# EAGLE design LabPower (EAGLE 7.7.0)
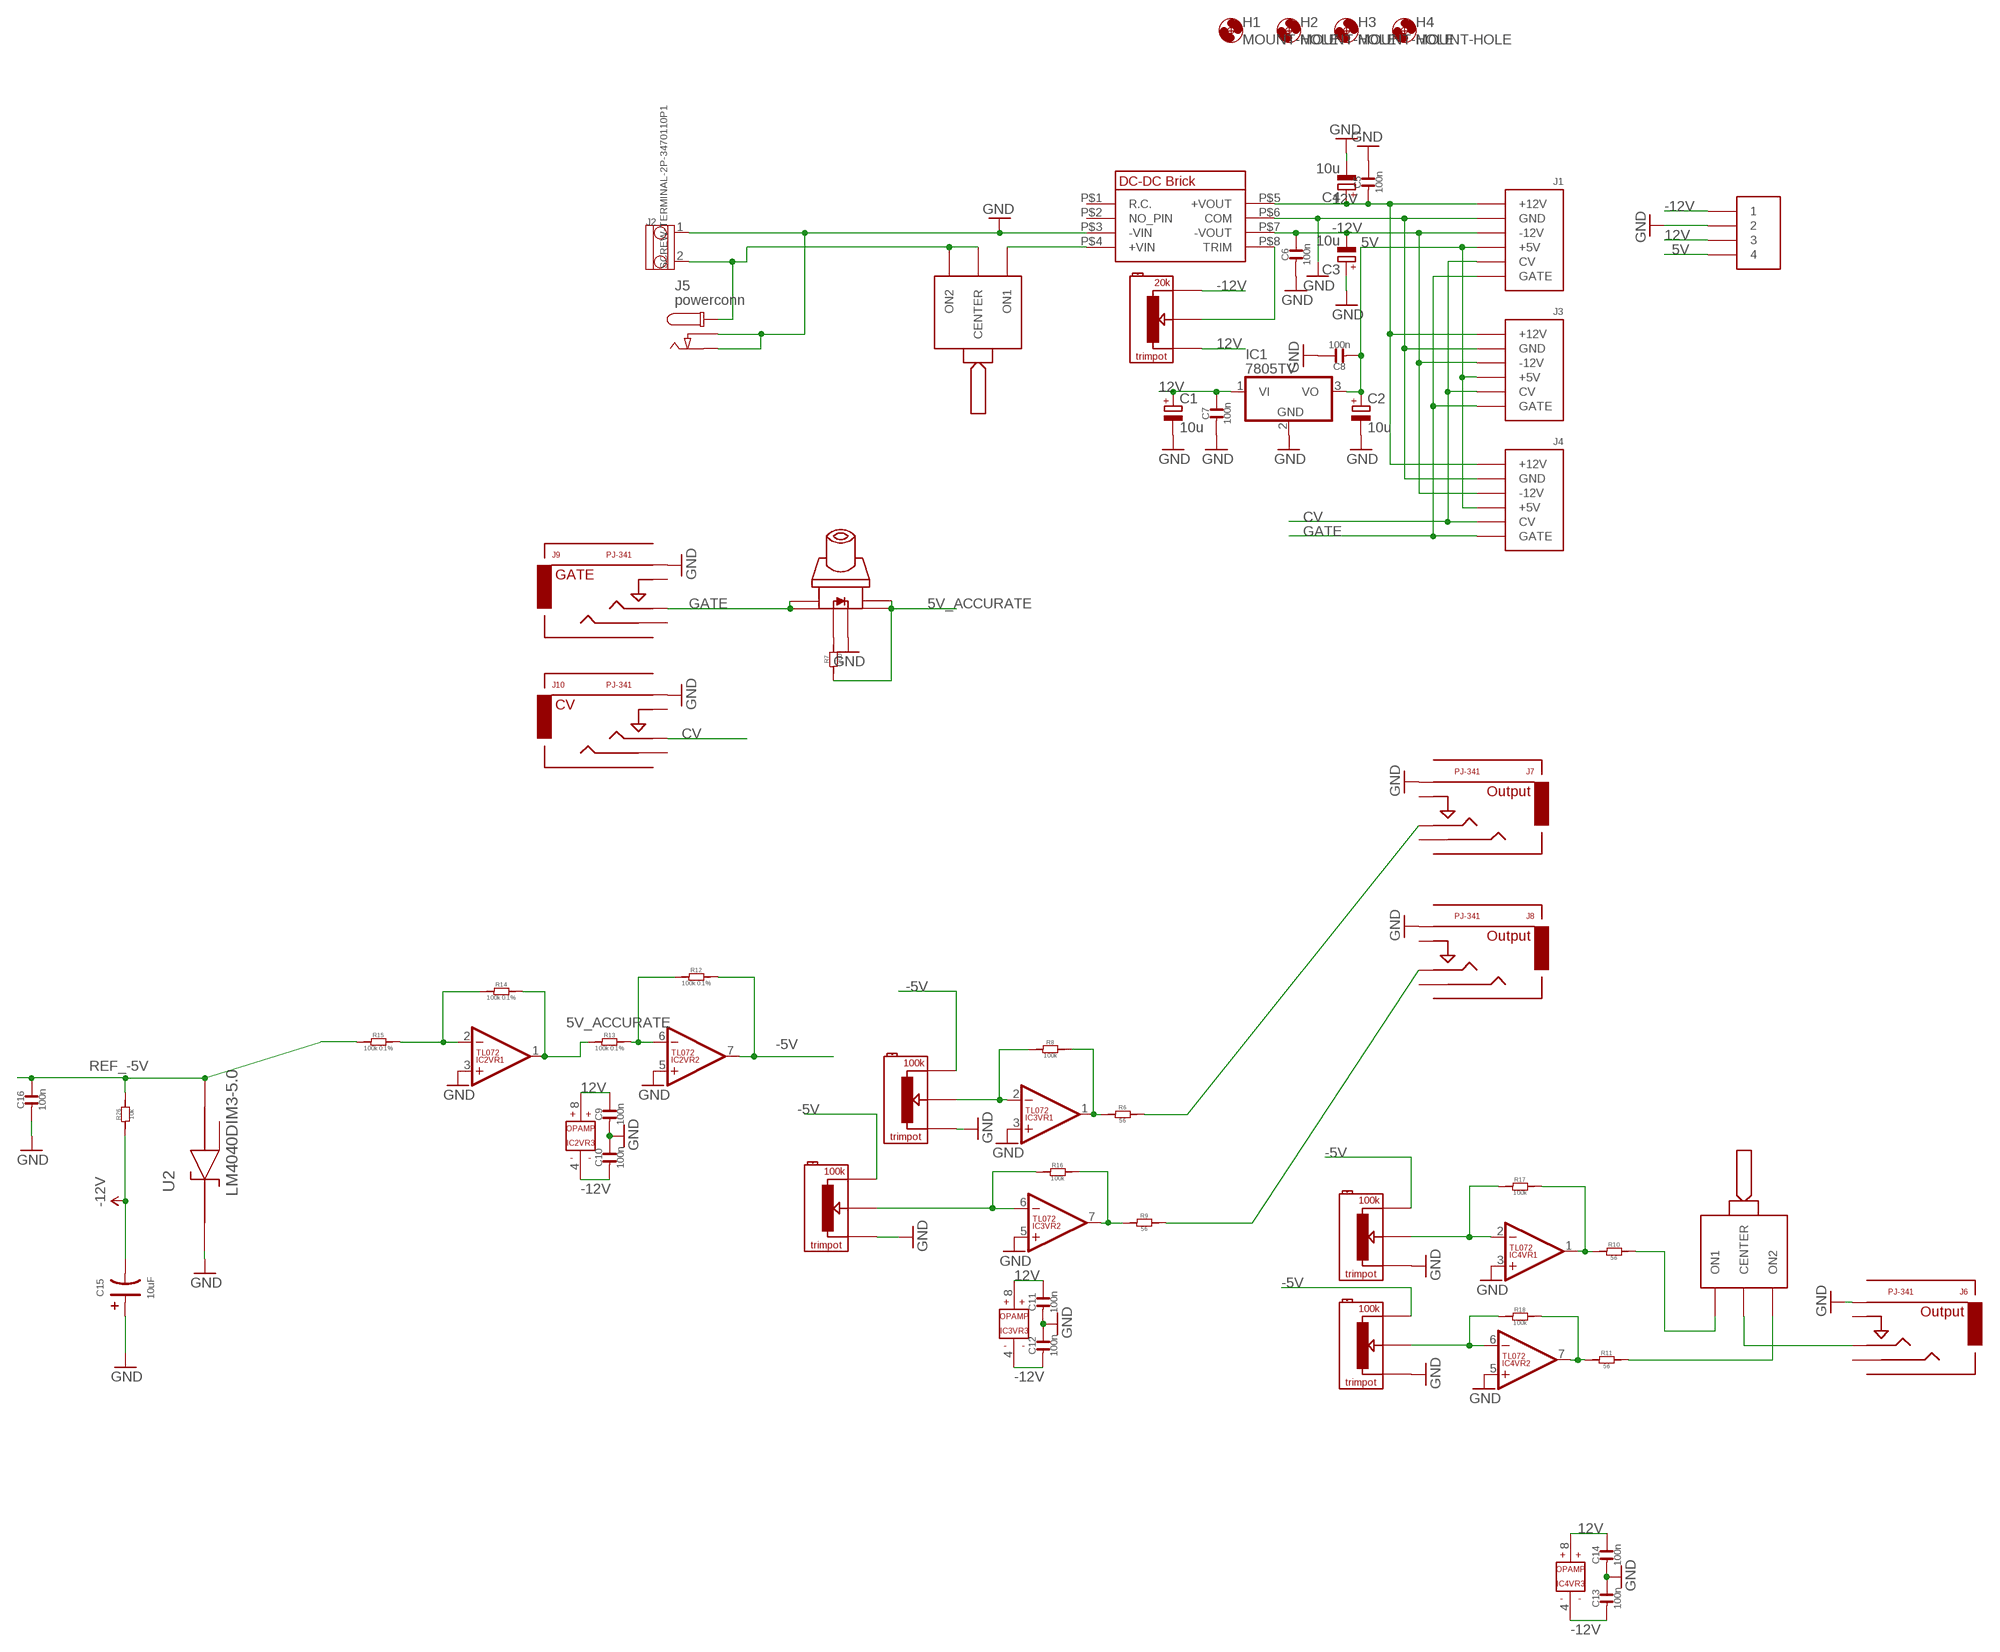
[diagram p0: schematic, sheet 1]

## Parts
C1  10u  CAPACITOR_POL-CASE_B  [CASE_B]
C2  10u  CAPACITOR_POL-CASE_B  [CASE_B]
C3  10u  CAPACITOR_POL-CASE_B  [CASE_B]
C4  10u  CAPACITOR_POL-CASE_B  [CASE_B]
C5  100n  C-0603  [C0603]
C6  100n  C-0603  [C0603]
C7  100n  C-0603  [C0603]
C8  100n  C-0603  [C0603]
C9  100n  C-0603  [C0603]
C10  100n  C-0603  [C0603]
C11  100n  C-0603  [C0603]
C12  100n  C-0603  [C0603]
C13  100n  C-0603  [C0603]
C14  100n  C-0603  [C0603]
C15  10uF  C-POLAR-A  [CASE-A_3216]
C16  100n  C-0603  [C0603]
H1  MOUNT-HOLE  [3.2-NOMARKINGS-SMALLSAFEZONE]
H2  MOUNT-HOLE  [3.2-NOMARKINGS-SMALLSAFEZONE]
H3  MOUNT-HOLE  [3.2-NOMARKINGS-SMALLSAFEZONE]
H4  MOUNT-HOLE  [3.2-NOMARKINGS-SMALLSAFEZONE]
IC1  7805TV  [TO220V]
IC2  TL072  [SO08]
IC3  TL072  [SO08]
IC4  TL072  [SO08]
J1  POWERSHROUDED  [POWER_16_SHROUDED]
J2  SCREW-TERMINAL-2P-3470110P1  [2P-5.0]
J3  POWER_SHROUDED_NOTEXT  [POWER_16_SHROUDED_NOTEXT]
J4  POWER_SHROUDED_NOTEXT  [POWER_16_SHROUDED_NOTEXT]
J5  powerconn  CON_DC_M-DC_PTH2  [DC_BARREL_JACK_PTH_2MM_2]
J6  PJ-341  AUDIO-JACKOUTPUT  [3.5MM-JACK-SWITCH-13MM-OUTPUT]
J7  PJ-341  AUDIO-JACKOUTPUT  [3.5MM-JACK-SWITCH-13MM-OUTPUT]
J8  PJ-341  AUDIO-JACKOUTPUT  [3.5MM-JACK-SWITCH-13MM-OUTPUT]
J9  PJ-341  AUDIO-JACKINPUT  [3.5MM-JACK-SWITCH-13MM-INPUT]
J10  PJ-341  AUDIO-JACKINPUT  [3.5MM-JACK-SWITCH-13MM-INPUT]
R1  20k  TRIMPOT  [TRIMPOT]
R2  100k  TRIMPOT  [TRIMPOT]
R3  100k  TRIMPOT  [TRIMPOT]
R4  100k  TRIMPOT  [TRIMPOT]
R5  100k  TRIMPOT  [TRIMPOT]
R6  56  R-0603  [R0603]
R7  200  R-0603  [R0603]
R8  100k  R-0603  [R0603]
R9  56  R-0603  [R0603]
R10  56  R-0603  [R0603]
R11  56  R-0603  [R0603]
R12  100k 0.1%  R-0603  [R0603]
R13  100k 0.1%  R-0603  [R0603]
R14  100k 0.1%  R-0603  [R0603]
R15  100k 0.1%  R-0603  [R0603]
R16  100k  R-0603  [R0603]
R17  100k  R-0603  [R0603]
R18  100k  R-0603  [R0603]
R26  10k  R-0603  [R0603]
S1  ONOFFON  [MULTICOMP1MS-ONOFFON]
S2  ONOFFON  [MULTICOMP1MS-ONOFFON]
S3  SWITCH_W_LED_PB6149L-X-102YELLOW  [PB6149L]
U2  LM4040DIM3-5.0  [SOT95P237X112-3N]
U$1  DKA30  [MEANWELL_DKA30]
U$2  4PIN5MM  [4PIN5MM]

## Nets
5V: C2.+ C8.1 IC1.3(VO) J1.11(+5V) J1.12(+5V) J3.11(+5V) J3.12(+5V) J4.11(+5V) J4.12(+5V) U$2.4
5V_ACCURATE: IC2.1(VR1:OUT) R7.1 R13.1 R14.2 S3.3 S3.4
12V: C1.+ C4.+ C5.1 C7.2 C9.2 C11.2 C14.2 IC1.1(VI) IC2.8(VR3:V+) IC3.8(VR3:V+) IC4.8(VR3:V+) J1.9(+12V) J1.10(+12V) J3.9(+12V) J3.10(+12V) J4.9(+12V) J4.10(+12V) R1.P$1 U$1.P$5(+VOUT) U$2.3
-5V: IC2.7(VR2:OUT) R2.P$3 R3.P$3 R4.P$3 R5.P$3 R12.2
-12V: C3.- C6.2 C10.1 C12.1 C13.1 C15.- IC2.4(VR3:V-) IC3.4(VR3:V-) IC4.4(VR3:V-) J1.1(-12V) J1.2(-12V) J3.1(-12V) J3.2(-12V) J4.1(-12V) J4.2(-12V) R1.P$3 R26.1 U$1.P$7(-VOUT) U$2.1
CV: J1.13(CV) J1.14(CV) J3.13(CV) J3.14(CV) J4.13(CV) J4.14(CV) J10.TIP@3(TIP)
GATE: J1.15(GATE) J1.16(GATE) J3.15(GATE) J3.16(GATE) J4.15(GATE) J4.16(GATE) J9.TIP@3(TIP) S3.1 S3.2
GND: C1.- C2.- C3.+ C4.- C5.2 C6.1 C7.1 C8.2 C9.1 C10.2 C11.1 C12.2 C13.2 C14.1 C15.+ C16.1 IC1.2(GND) IC2.3(VR1:+IN) IC2.5(VR2:+IN) IC3.3(VR1:+IN) IC3.5(VR2:+IN) IC4.3(VR1:+IN) IC4.5(VR2:+IN) J1.3(GND) J1.4(GND) J1.5(GND) J1.6(GND) J1.7(GND) J1.8(GND) J2.1 J3.3(GND) J3.4(GND) J3.5(GND) J3.6(GND) J3.7(GND) J3.8(GND) J4.3(GND) J4.4(GND) J4.5(GND) J4.6(GND) J4.7(GND) J4.8(GND) J5.P2(P3) J5.P3(P2) J6.RING@3(RING) J7.RING@3(RING) J8.RING@3(RING) J9.RING@3(RING) J10.RING@3(RING) R2.P$1 R3.P$1 R4.P$1 R5.P$1 S3.LEDNEG(NEG) U2.1(CATHODE) U$1.P$3(-VIN) U$1.P$6(COM) U$2.2
N$1: R7.2 S3.LEDPOS(POS)
N$2: J6.TIP@3(TIP) S2.2(CENTER)
N$3: IC2.2(VR1:-IN) R14.1 R15.2
N$4: R1.P$2 U$1.P$8(TRIM)
N$5: S1.1(ON1) U$1.P$4(+VIN)
N$7: IC2.6(VR2:-IN) R12.1 R13.2
N$8: IC3.6(VR2:-IN) R4.P$2 R16.1
N$9: IC3.1(VR1:OUT) R6.1 R8.2
N$10: IC3.7(VR2:OUT) R9.1 R16.2
N$11: J7.TIP@3(TIP) R6.2
N$12: J8.TIP@3(TIP) R9.2
N$13: IC3.2(VR1:-IN) R3.P$2 R8.1
N$15: IC4.1(VR1:OUT) R10.1 R17.2
N$16: R10.2 S2.1(ON1)
N$17: IC4.7(VR2:OUT) R11.1 R18.2
N$18: R11.2 S2.3(ON2)
N$19: IC4.2(VR1:-IN) R5.P$2 R17.1
N$21: IC4.6(VR2:-IN) R2.P$2 R18.1
POSITIVE_INPUT: J2.2 J5.P1 S1.2(CENTER) S1.3(ON2)
REF_-5V: C16.2 R15.1 R26.2 U2.2(ANODE)
Unconnected: J6.SECOND@3(SECOND) J6.SWITCH@3(SWITCH) J7.SECOND@3(SECOND) J7.SWITCH@3(SWITCH) J8.SECOND@3(SECOND) J8.SWITCH@3(SWITCH) J9.SECOND@3(SECOND) J9.SWITCH@3(SWITCH) J10.SECOND@3(SECOND) J10.SWITCH@3(SWITCH) U2.3(NC) U$1.P$1(R.C.) U$1.P$2(NO_PIN)

## Library data of the parts
C1-C4 = dp_devices:CAPACITOR_POL: Polarized capacitor in various packages
C5-C14 = OPL:C*
C15 = EurorackModularParts:C-POLAR*; MF: AVX; MPN: TAJB106K020RNJ; OC_FARNELL: 197427
C16 = OPL:C*; MF: AVX; MPN: 06035C104KAT2A; OC_FARNELL: 1301804
H1-H4 = zephod-components:MOUNT-HOLE: MOUNTING HOLE with drill center marker
IC1 = linear:78*: Positive VOLTAGE REGULATOR Source: http://cache.national.com/ds/LM/LM78L05.pdf http://www.fairchildsemi.com/ds/LM/LM7805.pdf
IC2-IC4 = EurorackModularParts:TL072
J1 J3 J4 = EurorackModularParts:POWER
J2 = OPL:SCREW-TERMINAL-2P
J5 = dp_devices:CON_DC_M: DC power connector
J6-J8 = EurorackModularParts:AUDIO-JACK: Switching Mono 3.5mm Audio Jack from Erthenvar.; DESC: Output; MPN: PJ-341
J9 = EurorackModularParts:AUDIO-JACK: Switching Mono 3.5mm Audio Jack from Erthenvar.; DESC: GATE; MPN: PJ-341
J10 = EurorackModularParts:AUDIO-JACK: Switching Mono 3.5mm Audio Jack from Erthenvar.; DESC: CV; MPN: PJ-341
R1-R5 = EurorackModularParts:TRIMPOT
R6-R18 = OPL:R*
R26 = OPL:R*; OC_FARNELL: unknown
S1 S2 = EurorackModularParts:ONOFFON
S3 = zephod-components:SWITCH_W_LED_PB6149L-X-102
U2 = FarnellThings:LM4040DIM3-5.0: IC, Precision Micropower Shunt Voltage Reference, 5V,SOT-23-3; MF: TEXAS INSTRUMENTS; MPN: LM4040DIM3-5.0; OC_FARNELL: 9778330; OC_NEWARK: 97K3489; PACKAGE: SOT-23-3; SUPPLIER: TEXAS INSTRUMENTS
U$1 = EurorackModularParts:DKA30
U$2 = EurorackModularParts:4PIN5MM

## Net classes
0 default: width 0.203 mm, clearance 0.178 mm
1 heavypower: width 0.381 mm
3 groundplane: width 0.178 mm, clearance 0.178 mm

## Board
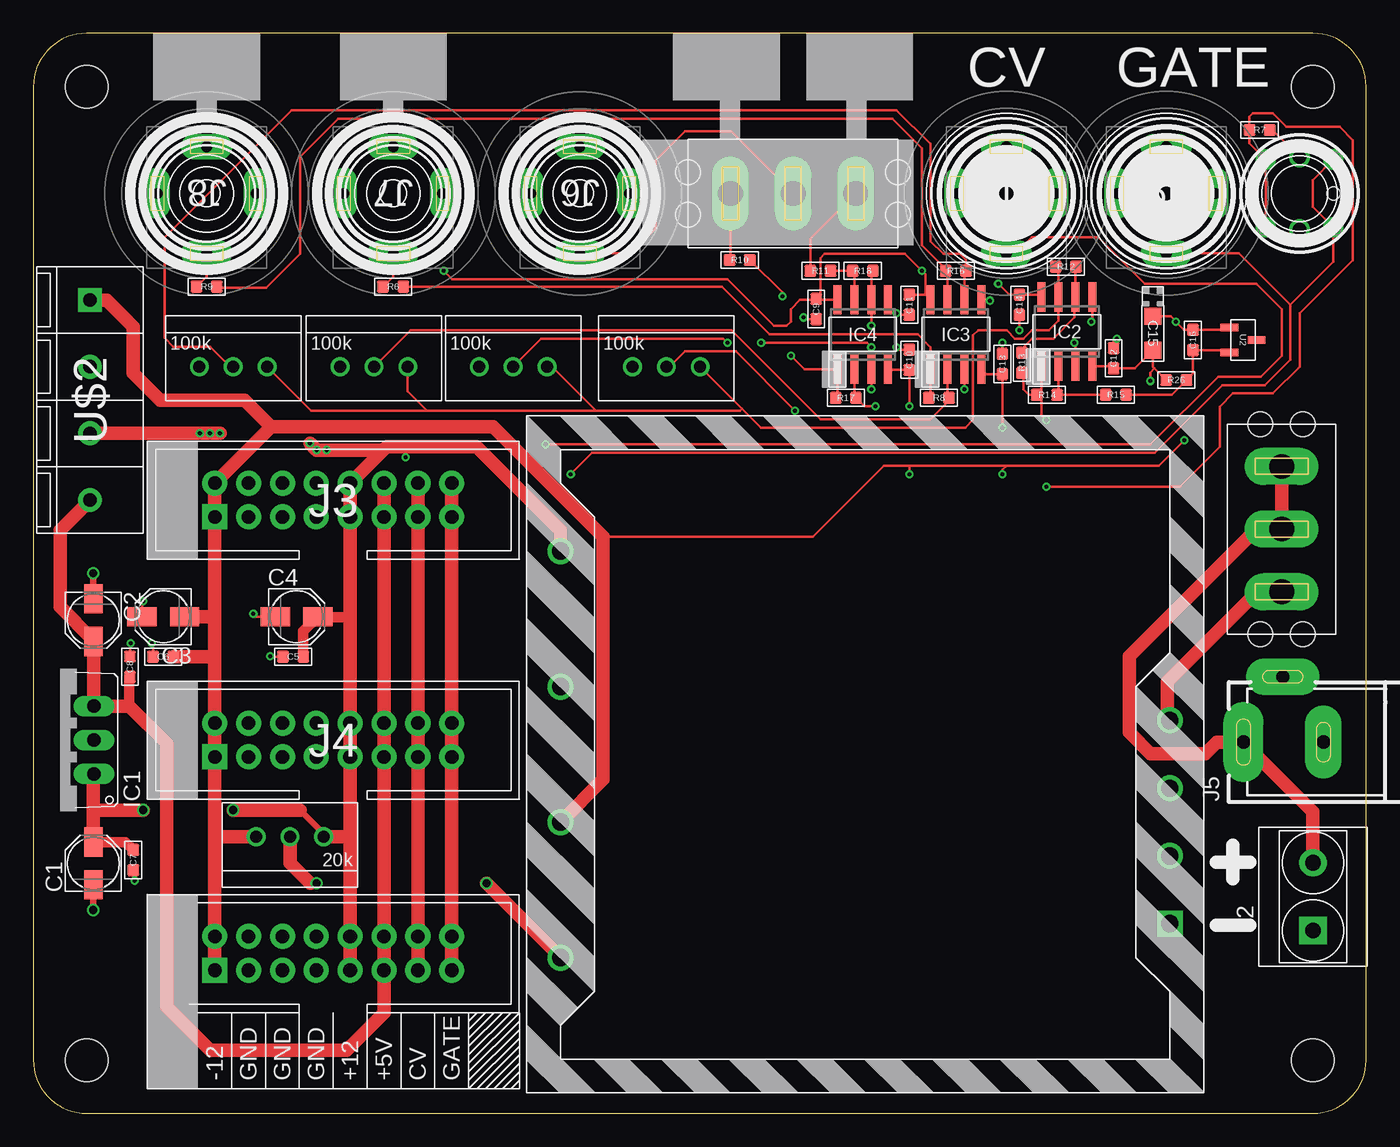
[diagram p1: board, top side]
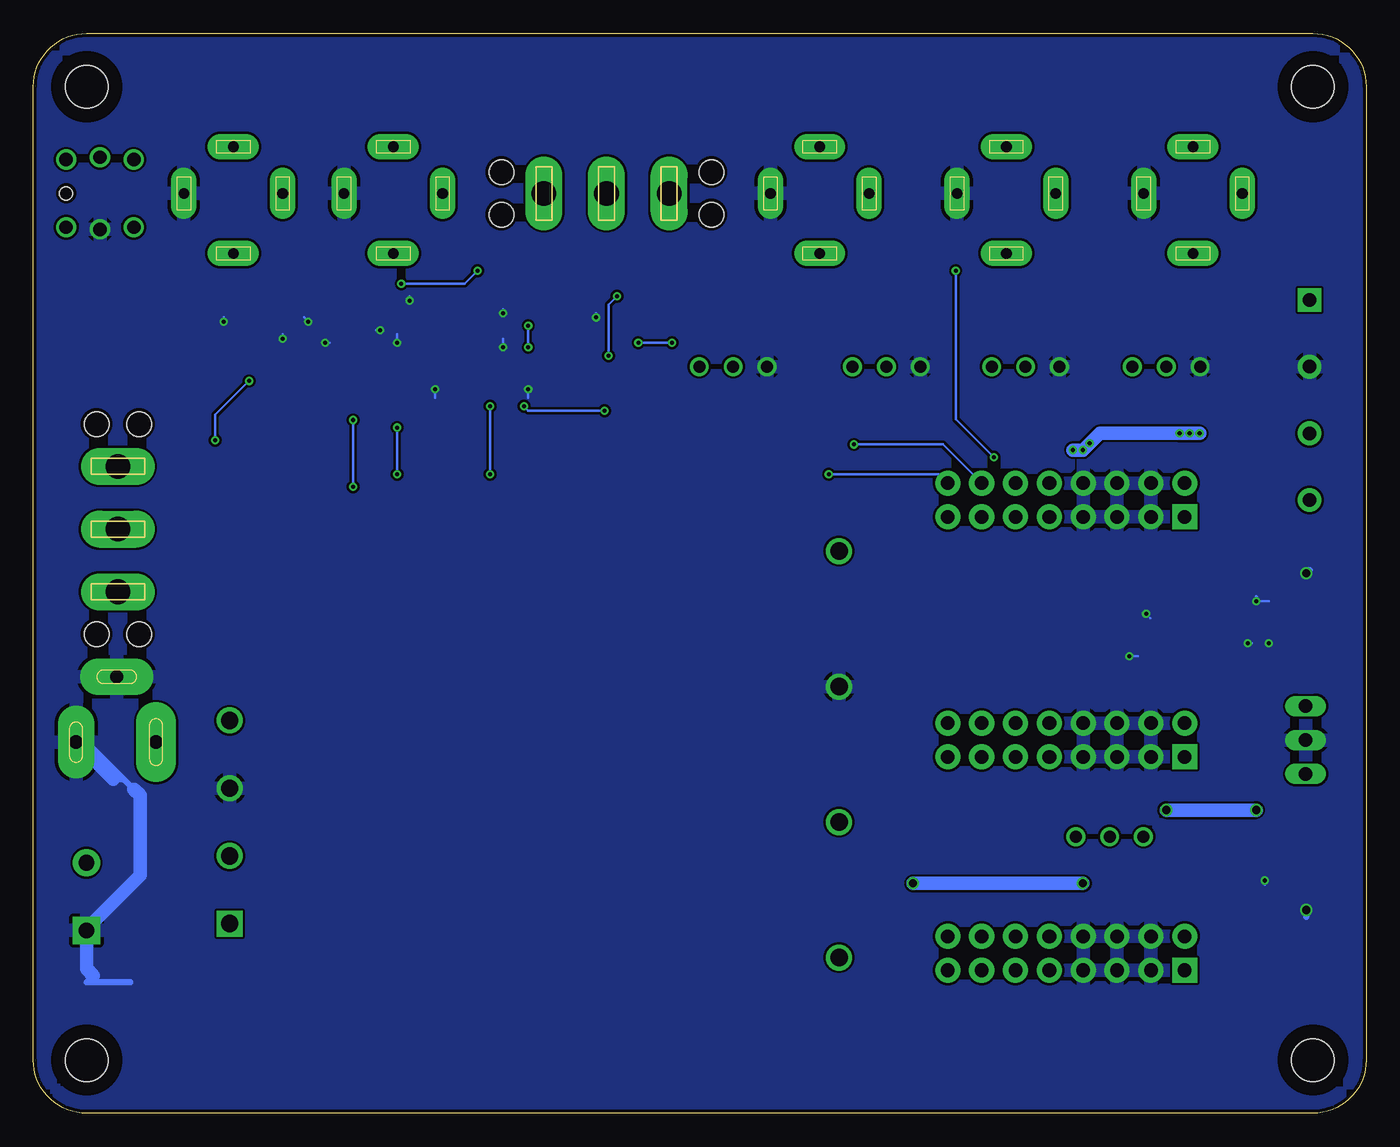
[diagram p2: board, bottom side, seen from below]

Size 100 x 81 mm. Coordinates in mm from the lower left corner, seen from the top.
Outline: 0,77 0,4 arc90 4,0 96,0 arc90 100,4 100,77 arc90 96,81 4,81 arc90 0,77
Copper layers (1*16): Top 0.035mm / dielectric 1.5mm / Bottom 0.035mm
Design rules "ITEADstudio_DRC": minimum track width 6mil, minimum drill 12mil, track to track 6mil, track to pad 6mil, pad to pad 6mil, via to via 6mil, smd to smd 0mil, copper to edge 10mil, drill to drill 10mil, minimum pad ring 10mil, minimum via ring 6mil, stop-mask expansion 2mil, vias tented up to drill 100mil, thermal gap 10mil

### Footprints (pad centres in the part's own frame; a part is rotated, then mirrored left to right if it is on the bottom)
CASE_B = smd 2.2 x 1.4: + 1.6,0; - -1.6,0
C0603 = smd 0.889 x 0.889: 1 -0.762,0; 2 0.762,0
CASE-A_3216 = smd 1.27 x 1.27: + -1.27,0; - 1.27,0
3.2-NOMARKINGS-SMALLSAFEZONE = hole 3.2: 0,0
TO220V = drill 1.016 long: 1 -2.54,-2.54; 2 0,-2.54; 3 2.54,-2.54
SO08 = smd 0.6 x 2.2: 1 -1.905,-2.6; 2 -0.635,-2.6; 3 0.635,-2.6; 4 1.905,-2.6; 5 1.905,2.6; 6 0.635,2.6; 7 -0.635,2.6; 8 -1.905,2.6
POWER_16_SHROUDED = drill 1.016 pad 1.88 square: 1 -8.89,-1.27 | drill 1.016 pad 1.88: 2 -8.89,1.27; 3 -6.35,-1.27; 4 -6.35,1.27; 5 -3.81,-1.27; 6 -3.81,1.27; 7 -1.27,-1.27; 8 -1.27,1.27; 9 1.27,-1.27; 10 1.27,1.27; 11 3.81,-1.27; 12 3.81,1.27; 13 6.35,-1.27; 14 6.35,1.27; 15 8.89,-1.27; 16 8.89,1.27
2P-5.0 = drill 1.168 pad 2.032 square: 1 -2.54,0 | drill 1.168 pad 2.032: 2 2.54,0
POWER_16_SHROUDED_NOTEXT = drill 1.016 pad 1.88 square: 1 -8.89,-1.27 | drill 1.016 pad 1.88: 2 -8.89,1.27; 3 -6.35,-1.27; 4 -6.35,1.27; 5 -3.81,-1.27; 6 -3.81,1.27; 7 -1.27,-1.27; 8 -1.27,1.27; 9 1.27,-1.27; 10 1.27,1.27; 11 3.81,-1.27; 12 3.81,1.27; 13 6.35,-1.27; 14 6.35,1.27; 15 8.89,-1.27; 16 8.89,1.27
DC_BARREL_JACK_PTH_2MM_2 = drill 1 pad 3 long: P1 0,5.205 | drill 1 pad 2.75 long: P2 4.9,2.255; P3 0,-0.795
3.5MM-JACK-SWITCH-13MM-OUTPUT = drill 0.8 pad 1.93 long: RING@3 -3.7,0; SECOND@3 0,-3.5; SWITCH@3 3.7,0; TIP@3 0,4.5
3.5MM-JACK-SWITCH-13MM-INPUT = drill 0.8 pad 1.93 long: RING@3 -3.7,0; SECOND@3 0,-3.5; SWITCH@3 3.7,0; TIP@3 0,4.5
TRIMPOT = drill 0.9: P$1 -2.54,0; P$2 0,0; P$3 2.54,0
R0603 = smd 0.889 x 0.889: 1 -0.762,0; 2 0.762,0
MULTICOMP1MS-ONOFFON = drill 1.85 long: 1 -4.7,0; 2 0,0; 3 4.7,0 | hole 1.85: -7.875,1.59; -7.875,-1.59; 7.875,1.59; 7.875,-1.59
PB6149L = drill 1: 1 2.54,2.54; 2 2.54,-2.54; 3 -2.54,2.54; 4 -2.54,-2.54; LEDNEG 0,-2.7; LEDPOS 0,2.7 | hole 1: 2.54,0
SOT95P237X112-3N = smd 1.321 x 0.559: 1 -1.016,0.94; 2 -1.016,-0.94; 3 1.016,0
MEANWELL_DKA30 = drill 1.3 square: P$1 0,0 | drill 1.3: P$2 5.08,0; P$3 10.16,0; P$4 15.24,0; P$5 27.94,45.72; P$6 17.78,45.72; P$7 7.62,45.72; P$8 -2.54,45.72
4PIN5MM = drill 1.016 pad 1.778 square: 1 -7.5,0 | drill 1.016 pad 1.778: 2 -2.5,0; 3 2.5,0; 4 7.5,0

### Placement (x,y rotation side)
C1  4.5,18.75 90 top
C2  4.5,37 270 top
C3  9.75,37.25 180 top
C4  19.75,37.25 0 top
C5  19.5,34.25 180 top
C6  9.75,34.25 0 top
C7  7.5,19 90 top
C8  7.25,33.5 90 top
C9  58.74,60.33 90 top
C10  65.72,56.52 90 top
C11  65.72,60.64 90 top
C12  81.05,56.63 90 top
C13  72.71,56.2 90 top
C14  73.98,60.64 90 top
C15  84,58.5 270 top
C16  87,58 270 top
H1  4,4 0 top
H2  96,4 0 top
H3  96,77 0 top
H4  4,77 0 top
IC1  2,28 90 top
IC2  77.55,58.63 0 top
IC3  69.22,58.42 0 top
IC4  62.23,58.42 0 top
J1  22.5,12 0 top
J2  96.01,16.26 90 top
J3  22.5,46 0 top
J4  22.5,28 0 top
J5  96,27.84 90 top
J6  41,69 180 top
J7  27,69 180 top
J8  13,69 180 top
J9  85,69 180 top
J10  73,69 180 top
R1  19.25,20.75 180 top
R2  36,56 0 top
R3  25.55,56 0 top
R4  15,56 0 top
R5  47.49,56 0 top
R6  27,62 180 top
R7  92,73.75 0 top
R8  67.94,53.66 180 top
R9  13,62 180 top
R10  53,64 180 top
R11  59.05,63.18 180 top
R12  77.47,63.5 180 top
R13  74.17,56.3 90 top
R14  76.05,53.88 180 top
R15  81.22,53.89 180 top
R16  69.22,63.18 180 top
R17  60.96,53.66 180 top
R18  62.23,63.18 180 top
R26  85.75,55 0 top
S1  93.66,43.81 90 top
S2  57,69 0 top
S3  95,69 0 top
U2  90.75,58 0 top
U$1  85.27,14.23 90 top
U$2  4.25,53.5 270 top

### Tracks (layer width: path | path; a pad name or v marks a point on that pad's centre or on a via)
5V
  Top 0.203: 7.21,32.7 C8.1
  Top 0.5: 4.54,35.36 C2.+
  Top 0.8: 7.21,30.54 7.21,32.7
  Top 1: J3.12 J3.11 J4.12 J4.11 J1.12 J1.11 26.31,7.56 23.5,4.75 13.25,4.75 10,8 10,27.75 7.21,30.54 IC1.3 4.54,35.36 | U$2.4 2,43.75 2,38 4.5,35.5 C2.+
5V_ACCURATE  (via drill 0.3)
  Top 0.203: R13.1 74.3,55.41 74.3,54.29 74.71,53.88 R14.2 75.64,54.24 IC2.1 75.64,52.36 v76,52 | S3.4 S3.3 91.24,72.76 R7.1 91.24,74.74 91.5,75 93,75 94,74 98,74 99,73 99,64 95,60 95,56 93,54 90,54 89,53 89,50 86,47 v76,47
  Bottom 0.203: v76,52 v76,47
12V  (via drill 0.3, 0.61)
  Top 0.203: IC4.8 58.8,61.02 | 58.8,61.02 C9.2 59.05,61.4 59.05,64.14 59.37,64.45 65.41,64.45 v66.67,63.18 66.92,62.93 66.92,61.4 | C11.2 66.92,61.4 | 66.92,61.4 IC3.8 | IC2.8 75.47,61.4 C14.2 73.22,61.4 v72.39,62.23 | 58.8,61.02 57.53,61.02 56.83,60.33 56.83,59.37 56.52,59.05 55.56,59.05 52.07,62.55 31.43,62.55 v30.8,63.18 | v27.94,49.21 27.94,50 | 21.4,37.2 C4.+ | 21,50 v21.25,49.75
  Top 0.5: 4.5,25.42 IC1.1 | R1.P$1 21.79,20.96 20,22.75
  Top 0.8: C1.+ 6.91,20.35 C7.2 | C5.1 20.26,36.16 C4.+ | 23.77,37.2 21.4,37.2
  Top 1: 23.77,20.75 J4.9 J4.10 23.77,37.2 J3.9 J3.10 26.25,49.75 | 23.77,20.75 J1.10 J1.9 | R1.P$1 23.77,20.75 | U$1.P$5 39.55,43.7 33.25,50 27.94,50 26.5,50 26.25,49.75 | C1.+ 4.5,22.75 | 4.5,22.75 4.5,25.42 | 20,22.75 v15,22.75 | v8.25,22.75 4.5,22.75 | U$2.3 v12.5,51 v13.25,51 v14,51 | 26.25,49.75 v22,49.75 v21.25,49.75 v20.75,50.25
  Bottom 0.203: v72.39,62.23 67.63,62.23 v66.67,63.18 | v30.8,63.18 30.8,52.07 v27.94,49.21
  Bottom 1: v15,22.75 v8.25,22.75 | v13.25,51 v14,51 | v14,51 20,51 v20.75,50.25 v21.25,49.75 v22,49.75 | v12.5,51 v14,51
-5V
  Top 0.203: R12.2 76.91,63.3 IC2.7 76.91,59.45 76.2,58.74 74.93,58.74 74.3,58.1 73.66,58.1 73.03,58.74 70.89,58.74 70.5,58.35 70.5,52 69.94,51.44 54.6,51.44 53.18,52.86 | 53.18,52.86 R5.P$3 | 29.53,52.7 42.23,52.7 | 42.23,52.7 53.02,52.7 53.18,52.86 | R2.P$3 38.93,56 42.23,52.7 | R4.P$3 20.84,52.7 29.53,52.7 | 29.53,52.7 28.09,54.14 R3.P$3
-12V  (via drill 0.3)
  Top 0.203: 13.57,34.25 13.61,34.29 | 13.51,37.25 13.61,37.15 | 84.12,55.87 84,55.99 C15.- 82.64,55.87 C12.1 80.89,56.03 IC2.4 | 84.12,55.87 R26.1 | 42.75,43.25 58.49,43.25 63.82,48.58 65.72,48.58 | 65.72,48.58 73.03,48.58 | 73.03,48.58 84.45,48.58 v86.36,50.48 | v83.82,54.93 83.82,55.56 84.12,55.87 | IC4.4 64.2,55.75 C10.1 v65.72,53.02 | v72.71,51.44 C13.1 71.5,55.44 IC3.4 | v72.71,47.94 72.71,48.26 73.03,48.58 | v65.72,47.94 65.72,48.58
  Top 0.5: 13.86,20.75 13.61,21
  Top 1: J1.1 J1.2 13.61,21 J4.1 J4.2 13.61,34.29 13.61,37.15 J3.1 J3.2 17.84,51.5 | R1.P$3 13.86,20.75 | U$1.P$7 42.75,25.05 42.75,43.25 34.5,51.5 17.84,51.5 | C6.2 13.57,34.25 | C3.- 13.51,37.25 | 17.84,51.5 15.84,53.5 9.5,53.5 7.5,55.5 7.5,59 5.5,61 U$2.1
  Bottom 0.203: v86.36,50.48 86.36,52.39 v83.82,54.93 | v72.71,51.44 v72.71,47.94 | v65.72,53.02 v65.72,47.94
CV  (via drill 0.3)
  Top 0.203: J10.TIP@3 73.71,64.5 74.93,65.72 79.92,65.72 83.41,62.23 91.76,62.23 93.66,60.33 93.66,56.83 92.08,55.24 88.9,55.24 83.82,50.16 v38.42,50.16
  Top 1: J3.14 J3.13 J4.14 J4.13 J1.14 J1.13
  Bottom 0.203: v38.42,50.16 31.75,50.16 J3.14
GATE  (via drill 0.3)
  Top 0.203: J9.TIP@3 90.44,64.5 94.3,60.64 | 94.3,60.64 94.3,56.52 92.39,54.61 89.22,54.61 84.14,49.53 41.91,49.53 v40.32,47.94 | 94.3,60.64 97.54,63.88 S3.2 96,68 96,70 S3.1
  Top 1: J1.15 J1.16 J4.15 J4.16 J3.15 J3.16
  Bottom 0.203: v40.32,47.94 32.06,47.94 J3.16
GND  (via drill 0.3, 0.61)
  Top 0.203: C6.1 8.99,35.15 v8.89,35.24 | C8.2 7.25,35.19 v7.3,35.24 | C3.+ 8.15,38.31 v8.26,38.42 | C7.1 7.5,17.58 v7.62,17.46 | U2.1 89.56,58.76 C16.1 86.33,58.76 v85.72,59.37 85.33,59.77 C15.+ | C12.2 81.05,57.87 v81.28,58.1 | IC2.5 79.45,59.45 v79.38,59.37 | IC2.3 78.18,57.71 v78.11,57.78 | C14.1 v73.98,58.74 | C13.2 v72.71,57.78 | C9.1 57.91,59.56 v57.78,59.69 | C11.1 64.9,59.88 v64.77,60.01 64.14,60.64 IC4.5 | C10.2 64.96,57.28 v64.77,57.47 | IC3.5 71.69,61.02 v71.75,60.96 | IC3.3 v69.85,54.29 | IC4.3 v62.87,54.29 | C5.2 17.82,34.25 v17.78,34.29 | C4.- 16.73,37.25 v16.51,37.47
  Top 0.5: C1.- v4.5,15.25 | C2.- v4.5,40.5
  Bottom 0.203: v8.89,35.24 8.57,35.24 | v8.26,38.42 7.3,38.42 | v7.62,17.46 7.62,17.14 | v85.72,59.37 85.72,59.69 | v81.28,58.1 81.28,58.42 | v79.38,59.37 79.69,59.69 | v78.11,57.78 77.79,57.78 | v73.98,58.74 74.3,58.74 | v72.71,57.78 72.71,58.42 | v57.78,59.69 57.78,60.01 | v64.77,60.01 64.77,60.33 | v64.77,57.47 64.77,58.1 | v71.75,60.96 71.75,61.28 | v69.85,54.29 69.85,53.66 | v62.87,54.29 62.87,53.66 | v17.78,34.29 17.14,34.29 | v16.51,37.47 16.19,37.15
  Bottom 0.254: v8.26,38.42 8.26,38.73
  Bottom 0.5: v4.5,15.25 4.5,14.75 | v4.5,40.5 4.5,40.75 4.25,40.75 | 95.5,10.34 96,9.84 92.72,9.84 | 94,25.05 93.2,25.05 | 93.2,25.05 92,23.84 | 93.2,25.05 96,27.84
  Bottom 1: 96.8,29.69 J5.P3 94,25.05 | J2.1 96.01,10.84 95.5,10.34 | 95.5,14.34 92,17.84 92,23.84 92.45,24.29
  pour Bottom: 1.5,85.75 101.25,85.75 arc-90 105.25,74.75 105.25,-2.75 0.25,-2.75 arc-90 -3.75,1.25 -3.75,73.5 arc-90
N$1
  Top 0.203: R7.2 92.76,73.94 S3.LEDPOS
N$2
  Top 0.203: J6.TIP@3 44.81,64.5 46.67,66.36 46.67,71.44 48.9,73.66 52.34,73.66 S2.2
N$3
  Top 0.203: IC2.2 76.91,53.98 R14.1 80.45,53.88 R15.2
N$4  (via drill 0.61)
  Top 0.5: U$1.P$8 | v21.25,17.25 20.75,17.25
  Top 1: U$1.P$8 v34,17.25 | 20.75,17.25 19.25,18.75 R1.P$2
  Bottom 1: v34,17.25 v21.25,17.25
N$5
  Top 1: S1.1 91.82,39.12 85.09,32.38 85.09,29.65 U$1.P$4
N$7
  Top 0.203: R13.2 74.17,57.34 74.93,58.1 76.52,58.1 78.11,59.69 78.11,61.15 IC2.6 78.18,63.45 R12.1
N$8
  Top 0.203: IC3.6 69.85,63.06 R16.1 69.98,64.01 69.53,64.45 68.26,64.45 67.31,65.41 67.31,72.71 64.77,75.25 19.37,75.25 9.84,65.72 9.84,58.16 10.5,57.5 13.25,57.5 14.75,56 R4.P$2
N$9
  Top 0.203: R6.1 51.66,62 55.24,58.42 66.36,58.42 67.31,57.47 IC3.1 67.31,53.78 R8.2
N$10
  Top 0.203: IC3.7 68.58,63.06 R16.2 68.45,63.31 66.67,65.09 66.67,72.39 64.45,74.61 22.86,74.61 20,71.75 20,64.45 17.46,61.91 13.85,61.91 R9.1
N$11
  Top 0.203: J7.TIP@3 27,62.76 R6.2
N$12
  Top 0.203: J8.TIP@3 13,62.76 R9.2
N$13
  Top 0.203: R8.1 68.58,53.78 IC3.2 68.58,53.34 67.31,52.07 59.05,52.07 52.39,58.74 28.29,58.74 R3.P$2
N$15  (via drill 0.3)
  Top 0.203: R17.2 60.33,53.78 IC4.1 57.84,55.82 v56.83,56.83 | v56.2,61.28 56.2,61.56 R10.1
  Bottom 0.203: v56.83,56.83 56.83,60.64 v56.2,61.28
N$16
  Top 0.203: S2.1 52.3,64.06 R10.2
N$17
  Top 0.203: R11.1 R18.2 61.59,63.06 IC4.7
N$18
  Top 0.203: R11.2 58.29,65.59 S2.3
N$19  (via drill 0.3)
  Top 0.203: IC4.2 61.59,53.78 R17.1 62.36,53.02 v63.18,53.02 | R5.P$2 47.74,56 48.9,57.15 52.7,57.15 v57.15,52.7
  Bottom 0.203: v57.15,52.7 62.87,52.7 v63.18,53.02
N$21  (via drill 0.3)
  Top 0.203: R18.1 62.87,63.06 IC4.6 v62.87,59.05 | R2.P$2 38.1,58.1 51.75,58.1 v52.07,57.78 | v62.87,57.47 62.55,57.78 v54.61,57.78
  Bottom 0.203: v62.87,59.05 v62.87,57.47 | v54.61,57.78 v52.07,57.78
POSITIVE_INPUT
  Top 1: J2.2 96.01,22.62 J5.P1 88.8,27.84 87.95,26.99 83.82,26.99 82.23,28.57 82.23,34.29 91.76,43.81 S1.2 S1.3
REF_-5V
  Top 0.203: U2.2 89.56,57.24 C16.2 87,55.49 R26.2 85.4,53.89 R15.1

### Text on the board
tPlace: CV | GATE